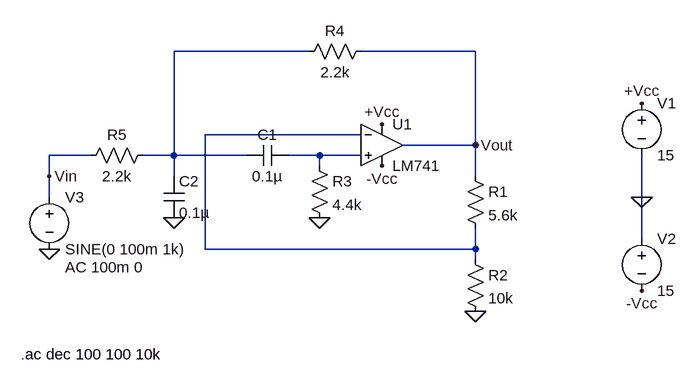
[diagram p0: schematic BPF.asc]
BPF.asc, the LTspice schematic file:
Version 4
SHEET 1 880 680
WIRE -48 -32 -256 -32
WIRE 208 -32 32 -32
WIRE 32 96 -208 96
WIRE 208 112 208 -32
WIRE 208 112 96 112
WIRE -384 128 -448 128
WIRE -256 128 -256 -32
WIRE -256 128 -304 128
WIRE -144 128 -256 128
WIRE -32 128 -80 128
WIRE 32 128 -32 128
WIRE -32 144 -32 128
WIRE -448 160 -448 128
WIRE -256 160 -256 128
WIRE 208 160 208 112
WIRE -448 192 -448 160
WIRE 464 192 464 128
WIRE 464 256 464 192
WIRE -208 272 -208 96
WIRE 208 272 208 240
WIRE 208 272 -208 272
WIRE 208 288 208 272
FLAG 464 192 0
FLAG 464 48 +Vcc
FLAG 464 336 -Vcc
FLAG -32 224 0
FLAG 208 368 0
FLAG 64 80 +Vcc
FLAG 64 144 -Vcc
FLAG 208 112 Vout
FLAG -256 224 0
FLAG -448 272 0
FLAG -448 160 Vin
SYMBOL voltage 464 32 R0
WINDOW 123 0 0 Left 0
WINDOW 39 0 0 Left 0
SYMATTR InstName V1
SYMATTR Value 15
SYMBOL voltage 464 240 R0
WINDOW 123 0 0 Left 0
WINDOW 39 0 0 Left 0
SYMATTR InstName V2
SYMATTR Value 15
SYMBOL res 192 144 R0
SYMATTR InstName R1
SYMATTR Value 5.6k
SYMBOL res 192 272 R0
SYMATTR InstName R2
SYMATTR Value 10k
SYMBOL OpAmps\\LM741 64 48 R0
SYMATTR InstName U1
SYMBOL res -48 128 R0
SYMATTR InstName R3
SYMATTR Value 4.4k
SYMBOL cap -80 112 R90
WINDOW 0 0 32 VBottom 2
WINDOW 3 32 32 VTop 2
SYMATTR InstName C1
SYMATTR Value 0.1µ
SYMBOL cap -272 160 R0
SYMATTR InstName C2
SYMATTR Value 0.1µ
SYMBOL res 48 -48 R90
WINDOW 0 0 56 VBottom 2
WINDOW 3 32 56 VTop 2
SYMATTR InstName R4
SYMATTR Value 2.2k
SYMBOL res -288 112 R90
WINDOW 0 0 56 VBottom 2
WINDOW 3 32 56 VTop 2
SYMATTR InstName R5
SYMATTR Value 2.2k
SYMBOL voltage -448 176 R0
WINDOW 123 24 124 Left 2
WINDOW 39 0 0 Left 0
SYMATTR InstName V3
SYMATTR Value SINE(0 100m 1k)
SYMATTR Value2 AC 100m 0
TEXT -492 434 Left 2 !.ac dec 100 100 10k

The netlist it stands for:
* BPF.asc
V1 +Vcc 0 15
V2 0 -Vcc 15
R1 Vout N002 5.6k
R2 N002 0 10k
XU1 N003 N002 +Vcc -Vcc Vout LM741  ; pins In+ In- V+ V- OUT
R3 N003 0 4.4k
C1 N003 N001 0.1µ
C2 N001 0 0.1µ
R4 Vout N001 2.2k
R5 N001 Vin 2.2k
V3 Vin 0 SINE(0 100m 1k) AC 100m 0
.ac dec 100 100 10k
.lib LM741.lib
.backanno
.end